# EAGLE design untitled (EAGLE 6.1)
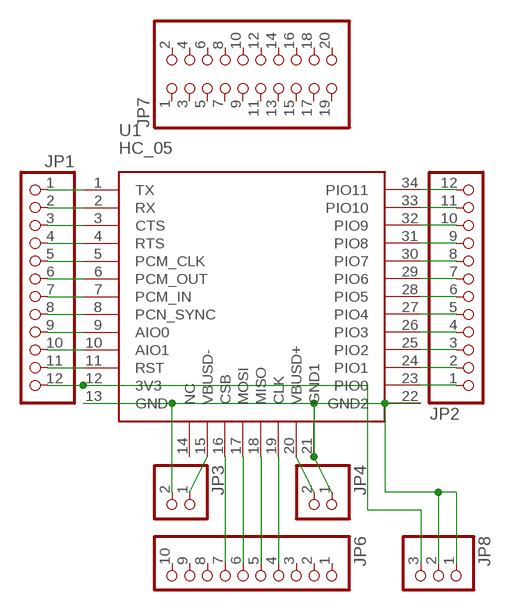
[diagram p0: schematic, sheet 1]

## Parts
JP1  PINHD-1X12  [1X12]
JP2  PINHD-1X12  [1X12]
JP3  PINHD-1X2  [1X02]
JP4  PINHD-1X2  [1X02]
JP6  PINHD-1X10  [1X10]
JP7  PINHD-2X10  [2X10]
JP8  PINHD-1X3  [1X03]
U1  HC_05  [BLUETOOTH_SMD]

## Nets
N$1: JP1.1 U1.1(TX)
N$2: JP1.2 U1.2(RX)
N$3: JP1.3 U1.3(CTS)
N$4: JP1.4 U1.4(RTS)
N$5: JP1.5 U1.5(PCM_CLK)
N$6: JP1.6 U1.6(PCM_OUT)
N$7: JP1.7 U1.7(PCM_IN)
N$8: JP1.8 U1.8(PCN_SYNC)
N$9: JP1.9 U1.9(AIO0)
N$10: JP1.10 U1.10(AIO1)
N$11: JP1.11 U1.11(RST)
N$13: JP3.2 JP4.1 JP8.1 JP8.2 U1.13(GND) U1.21(GND1) U1.22(GND2)
N$14: JP2.1 U1.23(PIO0)
N$15: JP2.2 U1.24(PIO1)
N$16: JP2.3 U1.25(PIO2)
N$17: JP1.12 JP8.3 U1.12(3V3)
N$18: JP2.4 U1.26(PIO3)
N$19: JP2.5 U1.27(PIO4)
N$20: JP2.6 U1.28(PIO5)
N$21: JP2.7 U1.29(PIO6)
N$22: JP2.8 U1.30(PIO7)
N$23: JP2.9 U1.31(PIO8)
N$24: JP2.10 U1.32(PIO9)
N$25: JP2.11 U1.33(PIO10)
N$26: JP2.12 U1.34(PIO11)
N$28: JP3.1 U1.15(VBUSD-)
N$29: JP6.7 U1.16(CSB)
N$30: JP6.6 U1.17(MOSI)
N$31: JP6.5 U1.18(MISO)
N$32: JP6.4 U1.19(CLK)
N$33: JP4.2 U1.20(VBUSD+)
Unconnected: JP6.1 JP6.2 JP6.3 JP6.8 JP6.9 JP6.10 JP7.1 JP7.2 JP7.3 JP7.4 JP7.5 JP7.6 JP7.7 JP7.8 JP7.9 JP7.10 JP7.11 JP7.12 JP7.13 JP7.14 JP7.15 JP7.16 JP7.17 JP7.18 JP7.19 JP7.20 U1.14(NC)

## Library data of the parts
JP1 JP2 = pinhead:PINHD-1X12: PIN HEADER
JP3 JP4 = pinhead:PINHD-1X2: PIN HEADER
JP6 = pinhead:PINHD-1X10: PIN HEADER
JP7 = pinhead:PINHD-2X10: PIN HEADER
JP8 = pinhead:PINHD-1X3: PIN HEADER
U1 = SerialPortBluetooth:HC_05

## Board
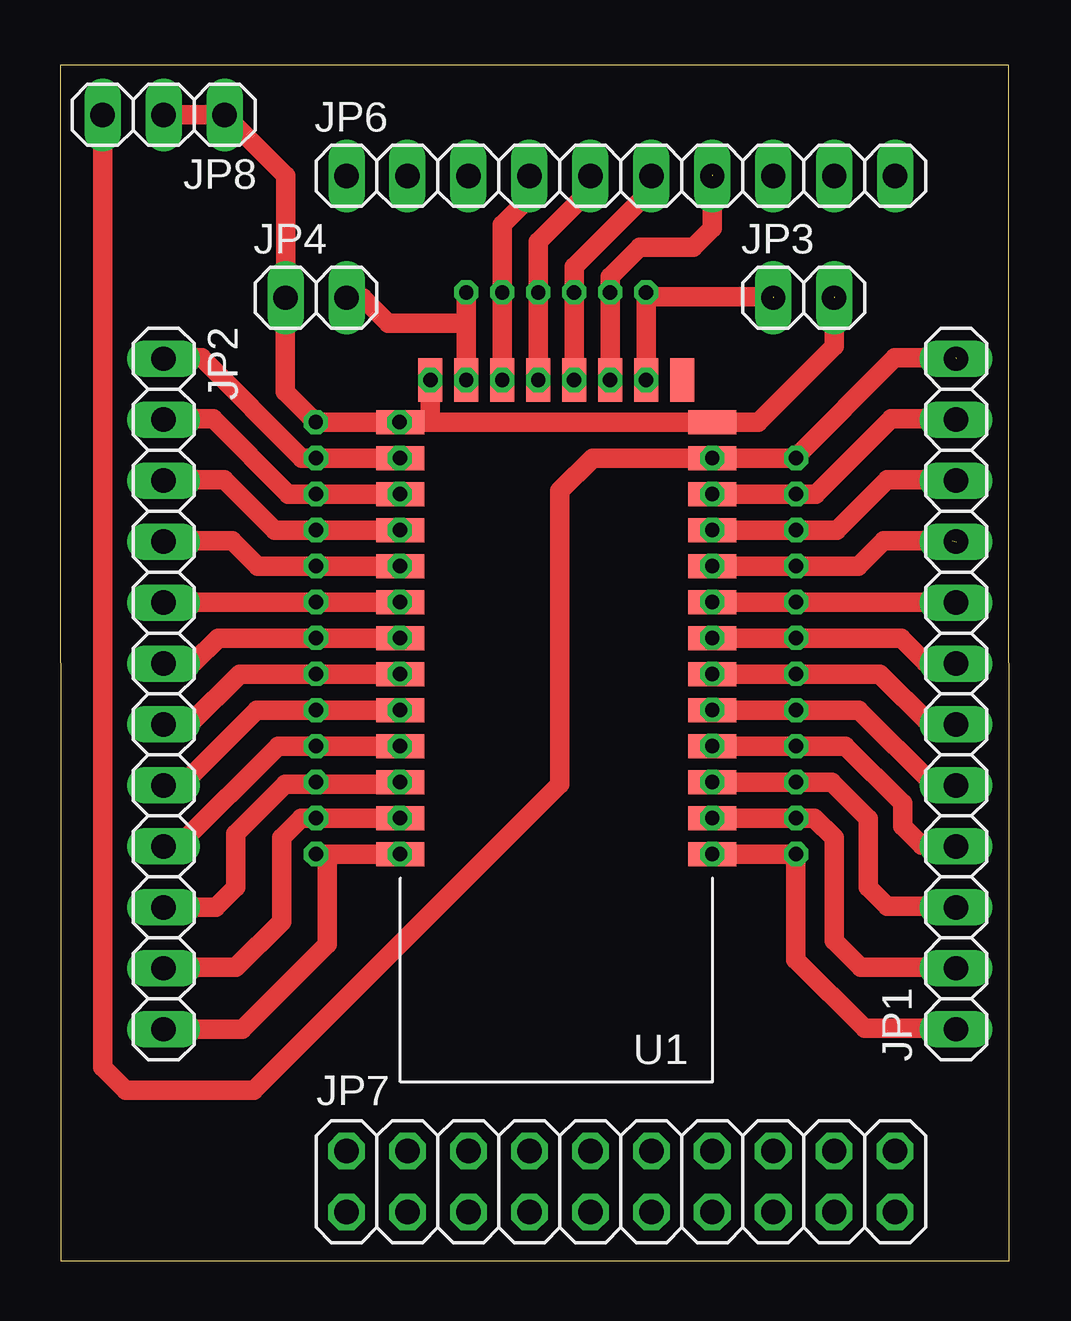
[diagram p1: board, top side]

Size 39.55 x 49.81 mm. Coordinates in mm from the lower left corner, seen from the top.
Outline: 0.03,0 39.55,0 39.52,49.81 0,49.81 0.03,0
Copper layers (1*16): Top 0.035mm / dielectric 1.5mm / Bottom 0.035mm
Design rules: minimum track width 10mil, minimum drill 24mil, track to track 8mil, track to pad 8mil, pad to pad 8mil, via to via 8mil, smd to smd 8mil, copper to edge 40mil, drill to drill 8mil, minimum pad ring 10mil, minimum via ring 8mil, stop-mask expansion 4mil, vias tented up to drill 0mil, thermal gap 10mil

### Footprints (pad centres in the part's own frame; a part is rotated, then mirrored left to right if it is on the bottom)
1X12 = drill 1.016 long: 1 -13.97,0; 2 -11.43,0; 3 -8.89,0; 4 -6.35,0; 5 -3.81,0; 6 -1.27,0; 7 1.27,0; 8 3.81,0; 9 6.35,0; 10 8.89,0; 11 11.43,0; 12 13.97,0
1X02 = drill 1.016 long: 1 -1.27,0; 2 1.27,0
1X10 = drill 1.016 long: 1 -11.43,0; 2 -8.89,0; 3 -6.35,0; 4 -3.81,0; 5 -1.27,0; 6 1.27,0; 7 3.81,0; 8 6.35,0; 9 8.89,0; 10 11.43,0
2X10 = drill 1.016 octagon: 1 -11.43,-1.27; 2 -11.43,1.27; 3 -8.89,-1.27; 4 -8.89,1.27; 5 -6.35,-1.27; 6 -6.35,1.27; 7 -3.81,-1.27; 8 -3.81,1.27; 9 -1.27,-1.27; 10 -1.27,1.27; 11 1.27,-1.27; 12 1.27,1.27; 13 3.81,-1.27; 14 3.81,1.27; 15 6.35,-1.27; 16 6.35,1.27; 17 8.89,-1.27; 18 8.89,1.27; 19 11.43,-1.27; 20 11.43,1.27
1X03 = drill 1.016 long: 1 -2.54,0; 2 0,0; 3 2.54,0
BLUETOOTH_SMD = smd 2 x 1: 1 0,0; 2 0,-1.5; 3 0,-3; 4 0,-4.5; 5 0,-6; 6 0,-7.5; 7 0,-9; 8 0,-10.5; 9 0,-12; 10 0,-13.5; 11 0,-15; 12 0,-16.5; 13 0,-18; 22 13,-18; 23 13,-16.5; 24 13,-15; 25 13,-13.5; 26 13,-12; 27 13,-10.5; 28 13,-9; 29 13,-7.5; 30 13,-6; 31 13,-4.5; 32 13,-3; 33 13,-1.5; 34 13,0 | smd 1 x 1.8: 14 1.25,-19.75; 15 2.75,-19.75; 16 4.25,-19.75; 17 5.75,-19.75; 18 7.25,-19.75; 19 8.75,-19.75; 20 10.25,-19.75; 21 11.75,-19.75

### Placement (x,y rotation side)
JP1  37.34,23.61 90 top
JP2  4.32,23.61 270 top
JP3  30.99,40.12 0 top
JP4  10.67,40.12 0 top
JP6  23.37,45.2 0 top
JP7  23.37,3.29 0 top
JP8  4.32,47.74 180 top
U1  27.18,16.94 180 top

### Tracks (layer width: path | path; a pad name or v marks a point on that pad's centre or on a via)
N$1  (via drill 0.6)
  Top 0.813: U1.1 30.62,16.94 30.66,16.99 30.66,12.54 33.52,9.68 37.29,9.68 JP1.1
  other vias: 27.18,16.94
N$2
  Top 0.813: U1.2 31.43,18.44 32.25,17.62 32.25,13.34 33.36,12.22 37.29,12.22 JP1.2
N$3
  Top 0.813: U1.3 32.15,19.94 33.68,18.41 33.68,15.56 34.47,14.76 37.29,14.76 JP1.3
N$4
  Top 0.813: U1.4 32.72,21.44 35.11,19.05 35.11,18.1 35.9,17.3 37.29,17.3 JP1.4
N$5
  Top 0.813: U1.5 33.28,22.94 36.38,19.84 37.29,19.84 JP1.5
N$6
  Top 0.813: U1.6 34.16,24.44 36.22,22.38 37.29,22.38 JP1.6
N$7
  Top 0.813: U1.7 35.04,25.94 36.06,24.92 37.29,24.92 JP1.7
N$8
  Top 0.813: U1.8 37.32,27.44 JP1.8
N$9  (1 unrouted)
  Top 0.813: U1.9 33.25,28.94 34.32,30 37.17,30 37.33,30
N$10
  Top 0.813: U1.10 32.37,30.44 34.47,32.54 37.29,32.54 JP1.10
N$11
  Top 0.813: U1.11 31.49,31.94 34.63,35.08 37.29,35.08 JP1.11
N$12  (via drill 0.6)
  other vias: 14.15,34.94
N$13  (1 unrouted)
  Top 0.813: JP8.2 JP8.1 9.4,45.2 JP4.1 9.39,36.2 10.66,34.92 14.16,34.92 U1.22 15.33,34.94 | 15.33,34.94 15.43,35.04 U1.21 | 15.33,34.94 U1.13 29.09,34.94 32.25,38.1 32.25,40.16
N$14
  Top 0.813: U1.23 10.08,33.44 5.9,37.62 4.36,37.62 JP2.1
N$15
  Top 0.813: U1.24 9.52,31.94 6.38,35.08 4.36,35.08 JP2.2
N$16
  Top 0.813: U1.25 8.95,30.44 6.85,32.54 4.36,32.54 JP2.3
N$17  (1 unrouted)
  Top 0.813: JP8.3 1.78,8.05 2.73,7.1 8.08,7.1 20.82,19.84 20.82,32.07 22.2,33.44 U1.12 30.61,33.44 34.79,37.62 37.33,37.62
N$18
  Top 0.813: U1.26 8.23,28.94 7.17,30 4.36,30 JP2.4
N$19
  Top 0.813: U1.27 4.34,27.44 JP2.5
N$20
  Top 0.813: U1.28 6.6,25.94 5.58,24.92 4.36,24.92 JP2.6
N$21
  Top 0.813: U1.29 7.48,24.44 5.42,22.38 4.36,22.38 JP2.7
N$22
  Top 0.813: U1.30 8.2,22.94 5.11,19.84 4.36,19.84 JP2.8
N$23
  Top 0.813: U1.31 9.08,21.44 4.95,17.3 4.36,17.3 JP2.9
N$24
  Top 0.813: JP2.10 6.49,14.72 7.33,15.56 7.33,17.78 9.39,19.84 14.08,19.84 U1.32
N$25
  Top 0.813: U1.33 10.05,18.44 9.23,17.62 9.23,14.13 7.33,12.22 4.36,12.22 JP2.11
N$26
  Top 0.813: U1.34 11.14,16.94 | 11.14,16.94 10.71,16.94 10.66,16.99 | JP2.12 7.6,9.64 11.14,13.18 11.14,16.94
N$28  (1 unrouted)
  Top 0.813: U1.15 24.43,40.28 24.47,40.32 24.47,40.16 29.71,40.16
N$29  (1 unrouted)
  Top 0.813: U1.16 22.93,41 24.16,42.23 26.38,42.23 27.17,43.02 27.17,45.24
N$30
  Top 0.813: U1.17 21.43,41.41 24.63,44.61 JP6.6
N$31
  Top 0.813: U1.18 19.93,42.45 22.09,44.61 JP6.5
N$32
  Top 0.813: U1.19 18.43,43.17 19.55,44.29 JP6.4
N$33
  Top 0.813: JP4.2 12.61,40.12 13.68,39.05 16.93,39.05 U1.20
N$34  (via drill 0.6)
  other vias: 14.16,33.44
N$35  (via drill 0.6)
  other vias: 14.16,31.94
N$36  (via drill 0.6)
  other vias: 14.16,30.44
N$37  (via drill 0.6)
  other vias: 14.16,28.94
N$38  (via drill 0.6)
  other vias: 14.16,27.44
N$39  (via drill 0.6)
  other vias: 14.16,25.95
N$40  (via drill 0.6)
  other vias: 14.16,24.45
N$41  (via drill 0.6)
  other vias: 14.16,22.94
N$42  (via drill 0.6)
  other vias: 14.16,21.44
N$43  (via drill 0.6)
  other vias: 14.16,19.94
N$44  (via drill 0.6)
  other vias: 14.16,18.44
N$45  (via drill 0.6)
  other vias: 14.16,16.94
N$47  (via drill 0.6)
  other vias: 27.18,33.44
N$48  (via drill 0.6)
  other vias: 27.18,31.94
N$49  (via drill 0.6)
  other vias: 27.18,30.44
N$50  (via drill 0.6)
  other vias: 27.18,28.94
N$51  (via drill 0.6)
  other vias: 27.18,27.44
N$52  (via drill 0.6)
  other vias: 27.18,25.95
N$53  (via drill 0.6)
  other vias: 27.18,24.45
N$54  (via drill 0.6)
  other vias: 27.18,22.95
N$55  (via drill 0.6)
  other vias: 27.18,21.45
N$56  (via drill 0.6)
  other vias: 27.18,19.94
N$57  (via drill 0.6)
  other vias: 27.18,18.44
N$59  (via drill 0.6)
  other vias: 24.42,36.69
N$60  (via drill 0.6)
  other vias: 22.92,36.69
N$61  (via drill 0.6)
  other vias: 21.42,36.69
N$62  (via drill 0.6)
  other vias: 19.93,36.69
N$63  (via drill 0.6)
  other vias: 18.43,36.69
N$64  (via drill 0.6)
  other vias: 16.93,36.69
N$65  (via drill 0.6)
  other vias: 15.43,36.69
N$79  (via drill 0.6)
  other vias: 10.66,34.94
N$80  (via drill 0.6)
  other vias: 10.67,33.44
N$81  (via drill 0.6)
  other vias: 10.67,31.94
N$82  (via drill 0.6)
  other vias: 10.67,30.44
N$83  (via drill 0.6)
  other vias: 10.67,28.94
N$84  (via drill 0.6)
  other vias: 10.67,27.44
N$85  (via drill 0.6)
  other vias: 10.67,25.95
N$86  (via drill 0.6)
  other vias: 10.67,24.45
N$87  (via drill 0.6)
  other vias: 10.67,22.94
N$88  (via drill 0.6)
  other vias: 10.67,21.44
N$89  (via drill 0.6)
  other vias: 10.67,19.94
N$90  (via drill 0.6)
  other vias: 10.67,18.44
N$91  (via drill 0.6)
  other vias: 10.67,16.94
N$93  (via drill 0.6)
  other vias: 30.67,33.44
N$94  (via drill 0.6)
  other vias: 30.67,31.94
N$95  (via drill 0.6)
  other vias: 30.67,30.44
N$96  (via drill 0.6)
  other vias: 30.67,28.94
N$97  (via drill 0.6)
  other vias: 30.67,27.44
N$98  (via drill 0.6)
  other vias: 30.67,25.95
N$99  (via drill 0.6)
  other vias: 30.67,24.45
N$100  (via drill 0.6)
  other vias: 30.67,22.94
N$101  (via drill 0.6)
  other vias: 30.67,21.44
N$102  (via drill 0.6)
  other vias: 30.67,19.94
N$103  (via drill 0.6)
  other vias: 30.67,18.44
N$104  (via drill 0.6)
  other vias: 30.67,16.94
N$111
  Top 0.813: 16.93,40.34 16.93,36.76 17.01,36.67
N$114  (via drill 0.6)
  other vias: 24.42,40.34
N$115  (via drill 0.6)
  other vias: 22.92,40.34
N$116  (via drill 0.6)
  other vias: 21.42,40.34
N$117  (via drill 0.6)
  other vias: 19.93,40.34
N$118  (via drill 0.6)
  other vias: 18.43,40.34
N$119  (via drill 0.6)
  other vias: 16.93,40.34